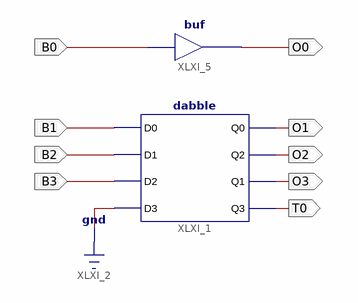
[diagram p0: schematic sheet 1]
// Xilinx ISE schematic dd4.sch (spartan6) as structural Verilog: 2 symbols, 9 ports
module dd4 (
  input  B1,
  input  B2,
  input  B3,
  input  B0,
  output O1,
  output O2,
  output O3,
  output T0,
  output O0
);

  dabble XLXI_1 (.D0(B1), .D1(B2), .D2(B3), .D3(1'b0), .Q0(O1), .Q1(O3), .Q2(O2), .Q3(T0));
  buf XLXI_5 (O0, B0);
endmodule
